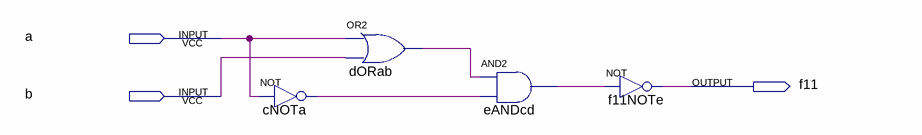
[diagram p0: schematic sheet]
// Quartus schematic Lab1.bdf as structural Verilog: 4 symbols, 3 pins
module Lab1 (
  input  a,
  input  b,
  output f11
);

  wire cNOTa_out, dORab_out, eANDcd_out;

  not cNOTa (cNOTa_out, a);
  or dORab (dORab_out, a, b);
  and eANDcd (eANDcd_out, dORab_out, cNOTa_out);
  not f11NOTe (f11, eANDcd_out);
endmodule
